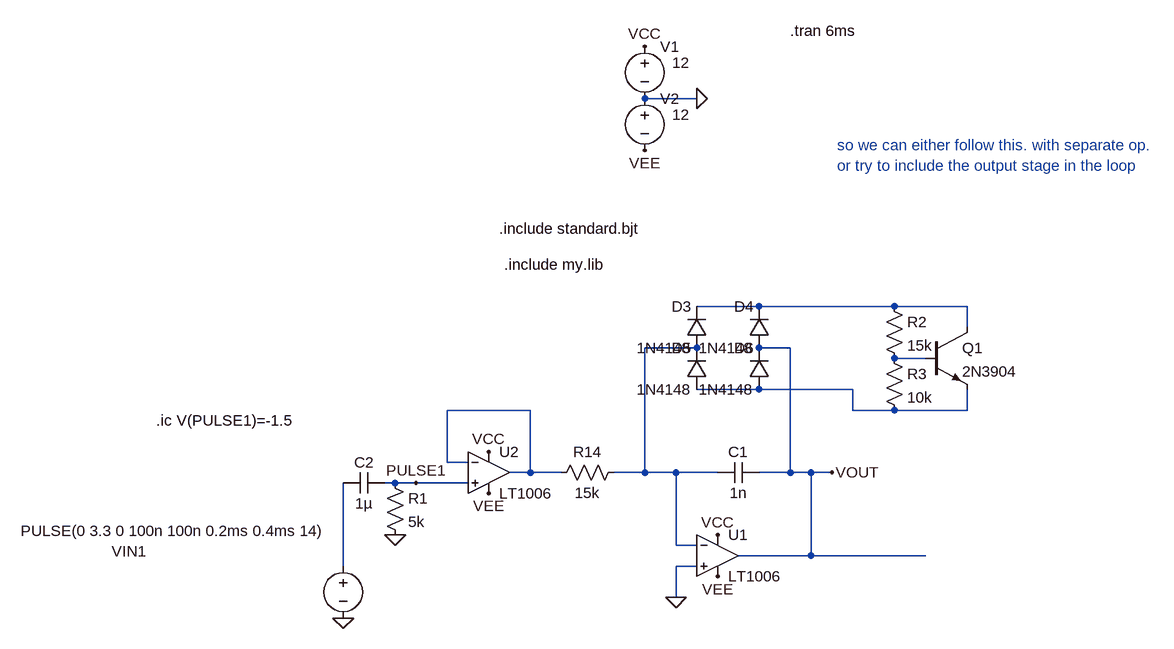
[diagram p0: schematic Draft105.asc]
Draft105.asc, the LTspice schematic file:
Version 4
SHEET 1 3300 1956
WIRE 544 -288 464 -288
WIRE 640 32 544 32
WIRE 848 32 640 32
WIRE 960 32 848 32
WIRE 960 64 960 32
WIRE 544 96 464 96
WIRE 688 96 640 96
WIRE 896 112 848 112
WIRE 640 160 544 160
WIRE 784 160 640 160
WIRE 288 192 160 192
WIRE 784 192 784 160
WIRE 848 192 784 192
WIRE 960 192 960 160
WIRE 960 192 848 192
WIRE 160 272 160 192
WIRE 192 272 160 272
WIRE 288 288 288 192
WIRE 288 288 256 288
WIRE 336 288 288 288
WIRE 464 288 464 96
WIRE 464 288 416 288
WIRE 512 288 464 288
WIRE 576 288 512 288
WIRE 688 288 688 96
WIRE 688 288 640 288
WIRE 720 288 688 288
WIRE 752 288 720 288
WIRE 80 304 64 304
WIRE 112 304 80 304
WIRE 192 304 112 304
WIRE 512 400 512 288
WIRE 544 400 512 400
WIRE 720 416 720 288
WIRE 720 416 608 416
WIRE 896 416 720 416
WIRE 0 432 0 304
WIRE 544 432 512 432
WIRE 512 480 512 432
FLAG 464 -368 VCC
FLAG 0 512 0
FLAG 544 -288 0
FLAG 512 480 0
FLAG 576 384 VCC
FLAG 752 288 VOUT
FLAG 464 -208 VEE
FLAG 576 448 VEE
FLAG 224 256 VCC
FLAG 224 320 VEE
FLAG 80 384 0
FLAG 112 304 PULSE1
SYMBOL voltage 464 -384 R0
WINDOW 123 0 0 Left 0
WINDOW 39 0 0 Left 0
WINDOW 3 42 41 Left 2
SYMATTR Value 12
SYMATTR InstName V1
SYMBOL voltage 0 416 R0
WINDOW 123 0 0 Left 0
WINDOW 39 0 0 Left 0
WINDOW 3 -496 -38 Left 2
WINDOW 0 -356 -7 Left 2
SYMATTR Value PULSE(0 3.3 0 100n 100n 0.2ms 0.4ms 14)
SYMATTR InstName VIN1
SYMBOL res 320 304 R270
WINDOW 0 32 56 VTop 2
WINDOW 3 0 56 VBottom 2
SYMATTR InstName R14
SYMATTR Value 15k
SYMBOL cap 640 272 R90
WINDOW 0 0 32 VBottom 2
WINDOW 3 32 32 VTop 2
SYMATTR InstName C1
SYMATTR Value 1n
SYMBOL OpAmps\\LT1006 576 352 R0
SYMATTR InstName U1
SYMBOL voltage 464 -304 R0
WINDOW 123 0 0 Left 0
WINDOW 39 0 0 Left 0
WINDOW 3 42 41 Left 2
SYMATTR Value 12
SYMATTR InstName V2
SYMBOL OpAmps\\LT1006 224 224 R0
SYMATTR InstName U2
SYMBOL cap 64 288 R90
WINDOW 0 0 32 VBottom 2
WINDOW 3 32 32 VTop 2
SYMATTR InstName C2
SYMATTR Value 1µ
SYMBOL res 64 288 R0
SYMATTR InstName R1
SYMATTR Value 5k
SYMBOL diode 560 96 R180
WINDOW 0 24 64 Left 2
WINDOW 3 24 0 Left 2
SYMATTR InstName D3
SYMATTR Value 1N4148
SYMBOL diode 656 96 R180
WINDOW 0 24 64 Left 2
WINDOW 3 24 0 Left 2
SYMATTR InstName D4
SYMATTR Value 1N4148
SYMBOL diode 560 160 R180
WINDOW 0 24 64 Left 2
WINDOW 3 24 0 Left 2
SYMATTR InstName D5
SYMATTR Value 1N4148
SYMBOL diode 656 160 R180
WINDOW 0 24 64 Left 2
WINDOW 3 24 0 Left 2
SYMATTR InstName D6
SYMATTR Value 1N4148
SYMBOL npn 896 64 R0
SYMATTR InstName Q1
SYMATTR Value 2N3904
SYMBOL res 832 16 R0
SYMATTR InstName R2
SYMATTR Value 15k
SYMBOL res 832 96 R0
SYMATTR InstName R3
SYMATTR Value 10k
TEXT 688 -392 Left 2 !.tran 6ms
TEXT 240 -88 Left 2 !.include standard.bjt
TEXT 760 -216 Left 2 ;so we can either follow this. with separate op.\nor try to include the output stage in the loop
TEXT 248 -32 Left 2 !.include my.lib
TEXT -288 208 Left 2 !.ic V(PULSE1)=-1.5

The netlist it stands for:
* Draft105.asc
V1 VCC 0 12
VIN1 N006 0 PULSE(0 3.3 0 100n 100n 0.2ms 0.4ms 14)
R14 N005 N002 15k
C1 VOUT N002 1n
XU1 0 N002 VCC VEE VOUT LT1006  ; pins In+ In- V+ V- OUT
V2 0 VEE 12
XU2 PULSE1 N005 VCC VEE N005 LT1006  ; pins In+ In- V+ V- OUT
C2 PULSE1 N006 1µ
R1 PULSE1 0 5k
D3 N002 N001 1N4148
D4 VOUT N001 1N4148
D5 N004 N002 1N4148
D6 N004 VOUT 1N4148
Q1 N001 N003 N004 0 2N3904
R2 N001 N003 15k
R3 N003 N004 10k
.model D D
.lib standard.dio
.model NPN NPN
.model PNP PNP
.lib standard.bjt
.tran 6ms
.include standard.bjt
* so we can either follow this. with separate op.
* or try to include the output stage in the loop
.include my.lib
.ic V(PULSE1)=-1.5
.lib LTC.lib
.backanno
.end